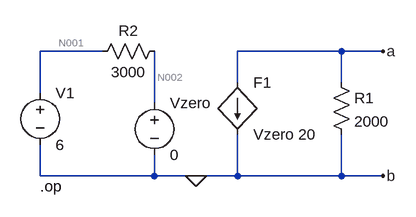
[diagram p0: schematic dependent_source_diy.asc]
dependent_source_diy.asc, the LTspice schematic file:
Version 4
SHEET 1 880 680
WIRE 96 64 0 64
WIRE 464 64 304 64
WIRE 528 64 464 64
WIRE 304 112 304 64
WIRE 464 112 464 64
WIRE 0 128 0 64
WIRE 176 144 176 64
WIRE 0 256 0 208
WIRE 176 256 176 224
WIRE 176 256 0 256
WIRE 240 256 176 256
WIRE 304 256 304 192
WIRE 304 256 240 256
WIRE 464 256 464 192
WIRE 464 256 304 256
WIRE 528 256 464 256
FLAG 528 64 a
FLAG 528 256 b
FLAG 240 256 0
SYMBOL voltage 0 112 R0
SYMATTR InstName V1
SYMATTR Value 6
SYMBOL res 448 96 R0
SYMATTR InstName R1
SYMATTR Value 2000
SYMBOL res 192 48 R90
WINDOW 0 0 56 VBottom 2
WINDOW 3 32 56 VTop 2
SYMATTR InstName R2
SYMATTR Value 3000
SYMBOL f 304 112 R0
SYMATTR InstName F1
SYMATTR Value Vzero 20
SYMBOL voltage 176 128 R0
SYMATTR InstName Vzero
SYMATTR Value 0
TEXT 0 272 Left 2 !.op

The netlist it stands for:
* dependent_source_diy.asc
V1 N001 0 6
R1 a 0 2000
R2 N002 N001 3000
F1 a 0 Vzero 20
Vzero N002 0 0
.op
.backanno
.end

* Results of the author's LTspice run, read from the files saved beside the schematic
* Operating Point:
*   V(n001) = 6 V
*   V(a) = -80 V
*   V(n002) = 0 V
*   I(F1) = 40 mA
*   I(R2) = -2 mA
*   I(R1) = -40 mA
*   I(Vzero) = 2 mA
*   I(V1) = -2 mA